# Altium schematic sheet Top_Sheet.SchDoc
size A; SheetNumber: 1; SheetTotal: 6
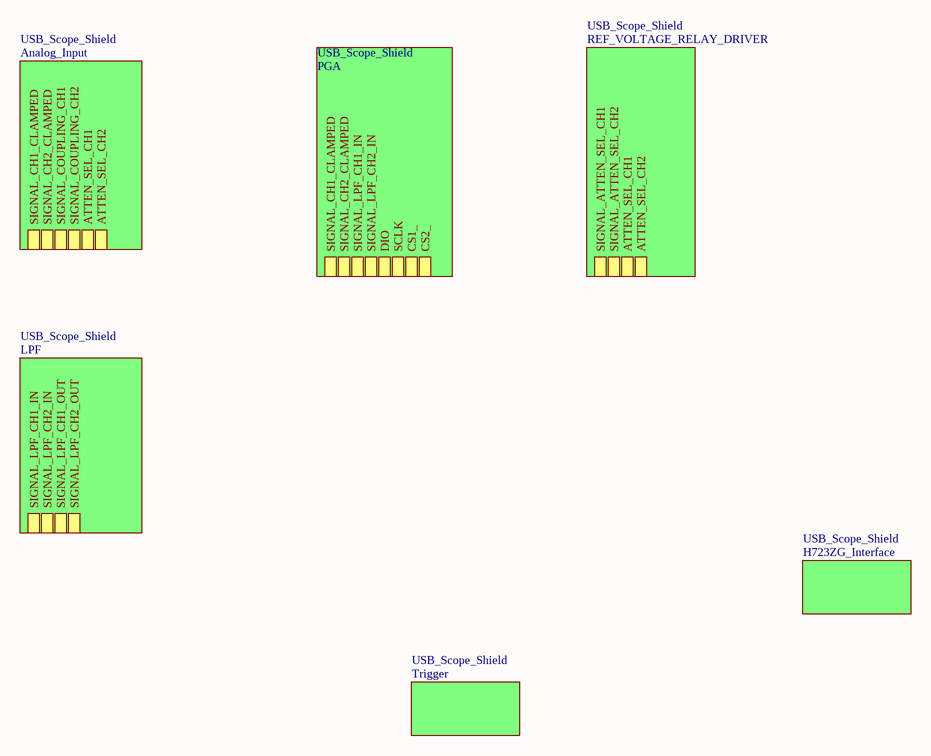
[diagram p0: Top_Sheet.SchDoc]

## Sub-sheets
USB_Scope_Shield = Analog_Input: SIGNAL_CH1_CLAMPED, SIGNAL_CH2_CLAMPED, SIGNAL_COUPLING_CH1, SIGNAL_COUPLING_CH2, ATTEN_SEL_CH1, ATTEN_SEL_CH2
USB_Scope_Shield = PGA: SIGNAL_CH1_CLAMPED, SIGNAL_CH2_CLAMPED, SIGNAL_LPF_CH1_IN, SIGNAL_LPF_CH2_IN, DIO, SCLK, CS1_, CS2_
USB_Scope_Shield = REF_VOLTAGE_RELAY_DRIVER: SIGNAL_ATTEN_SEL_CH1, SIGNAL_ATTEN_SEL_CH2, ATTEN_SEL_CH1, ATTEN_SEL_CH2
USB_Scope_Shield = LPF: SIGNAL_LPF_CH1_IN, SIGNAL_LPF_CH2_IN, SIGNAL_LPF_CH1_OUT, SIGNAL_LPF_CH2_OUT
USB_Scope_Shield = Trigger: no entries
USB_Scope_Shield = H723ZG_Interface: no entries